# EAGLE design GabozePocaio-Extension-Button-Audio (EAGLE 9.0.0)
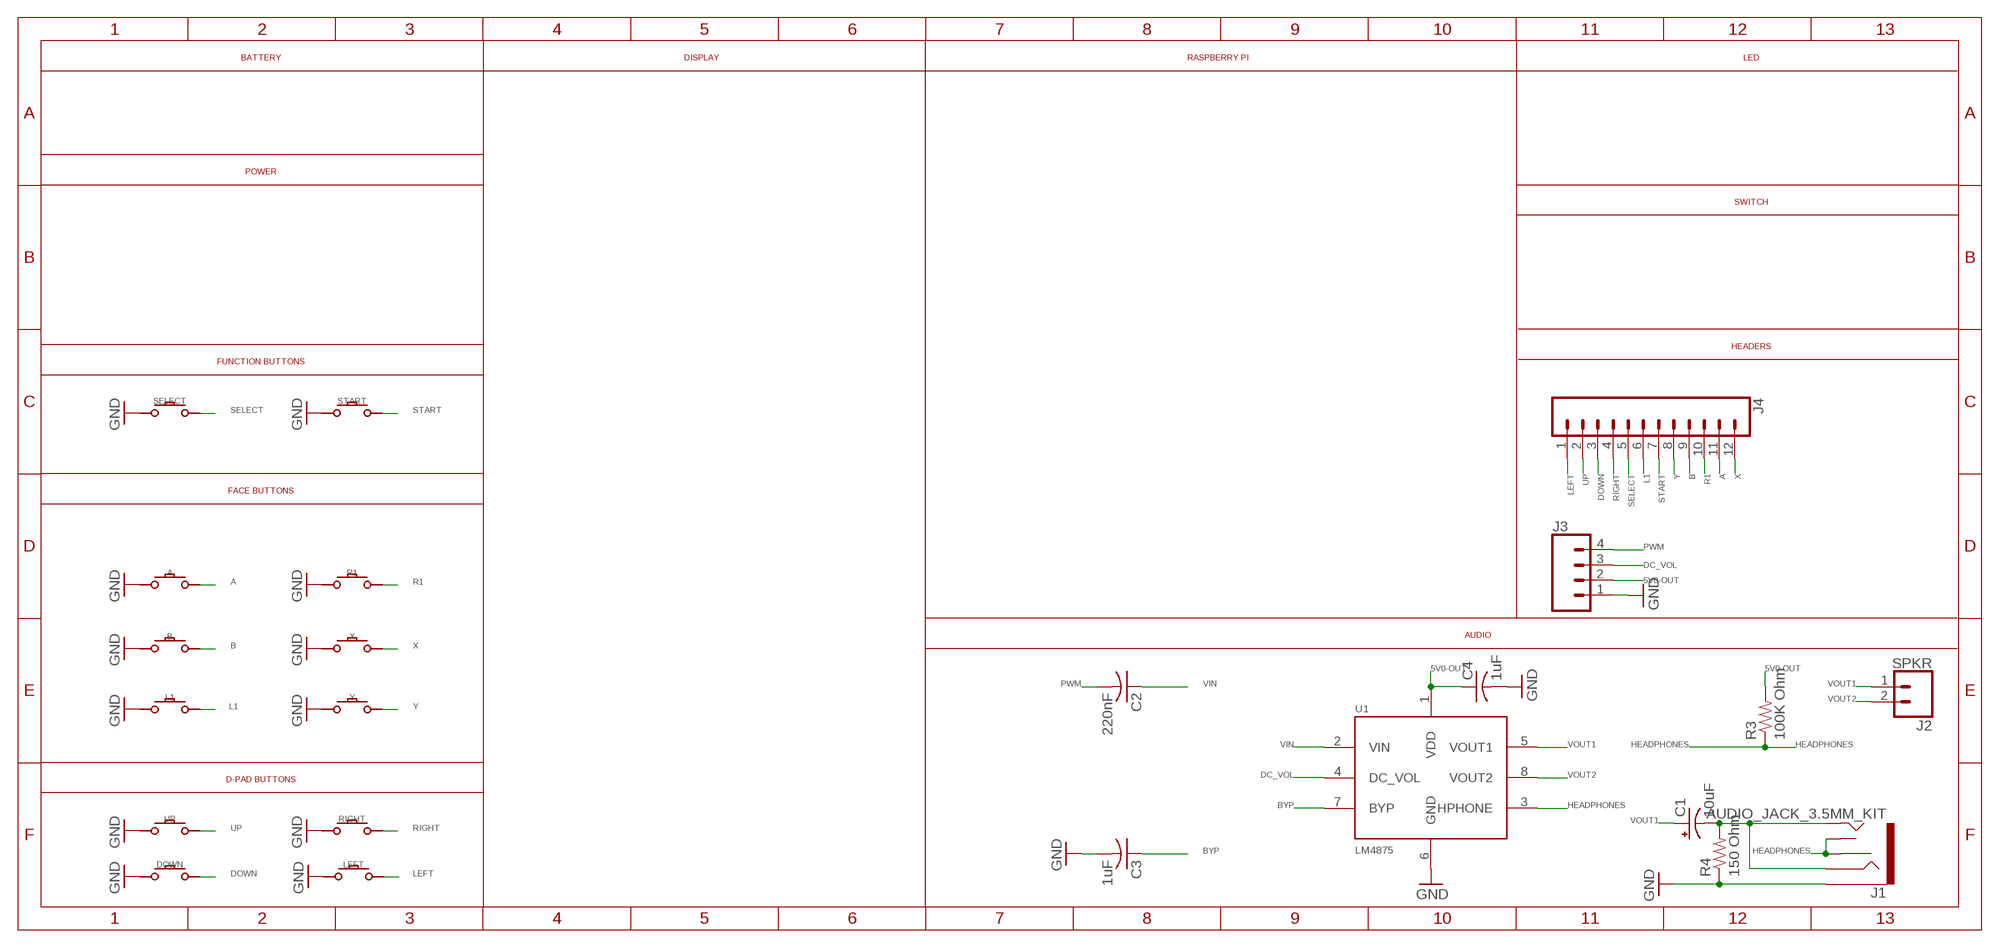
[diagram p0: schematic, sheet 1]

## Parts
A  CONDUCTIVE_BUTTON  [CONDUCTIVE_BUTTON]
B  CONDUCTIVE_BUTTON  [CONDUCTIVE_BUTTON]
C1  10uF  10UF-POLAR-EIA3216-16V-10%(TANT)  [EIA3216]
C2  220nF  C-USC0805  [C0805]
C3  1uF  C-USC0805  [C0805]
C4  1uF  C-USC0805  [C0805]
DOWN  CONDUCTIVE_BUTTON  [CONDUCTIVE_BUTTON]
J1  AUDIO_JACK_3.5MM_KIT  [AUDIO-JACK-KIT]
J2  SPKR  CONN_02  [1X02]
J3  CONN_041X04_NO_SILK  [1X04_NO_SILK]
J4  CONN_12NO_SILK  [1X12_NO_SILK]
L1  CONDUCTIVE_BUTTON_DRILL  [CONDUCTIVE_BUTTON_DRILL]
LEFT  CONDUCTIVE_BUTTON  [CONDUCTIVE_BUTTON]
R1  CONDUCTIVE_BUTTON_DRILL  [CONDUCTIVE_BUTTON_DRILL]
R3  100K Ohm  R-US_R0805  [R0805]
R4  150 Ohm  R-US_R0805  [R0805]
RIGHT  CONDUCTIVE_BUTTON  [CONDUCTIVE_BUTTON]
SELECT  CONDUCTIVE_BUTTON_STARTSELECT  [CONDUCTIVE_BUTTON_STARTSELECT]
START  CONDUCTIVE_BUTTON_STARTSELECT  [CONDUCTIVE_BUTTON_STARTSELECT]
U1  LM4875  [SOIC8]
UP  CONDUCTIVE_BUTTON  [CONDUCTIVE_BUTTON]
X  CONDUCTIVE_BUTTON_DRILL  [CONDUCTIVE_BUTTON_DRILL]
Y  CONDUCTIVE_BUTTON_DRILL  [CONDUCTIVE_BUTTON_DRILL]

## Nets
5V0-OUT: C4.1 J3.2 R3.2 U1.1(VDD)
A: A.P$ACTIVE J4.11
B: B.P$ACTIVE J4.9
BYP: C3.1 U1.7(BYP)
DC_VOL: J3.3 U1.4(DC_VOL)
DOWN: DOWN.P$ACTIVE J4.3
GND: A.P$GND B.P$GND C3.2 C4.2 DOWN.P$GND J1.SLEEVE J3.1 L1.P$GND LEFT.P$GND R1.P$GND R4.1 RIGHT.P$GND SELECT.P$GND START.P$GND U1.6(GND) UP.P$GND X.P$GND Y.P$GND
HEADPHONES: J1.RSH J1.TSH R3.1 U1.3(HPHONE)
L1: J4.6 L1.P$ACTIVE
LEFT: J4.1 LEFT.P$ACTIVE
PWM: C2.2 J3.4
R1: J4.10 R1.P$ACTIVE
RIGHT: J4.4 RIGHT.P$ACTIVE
SELECT: J4.5 SELECT.P$ACTIVE
START: J4.7 START.P$ACTIVE
UP: J4.2 UP.P$ACTIVE
VIN: C2.1 U1.2(VIN)
VIN1: C1.- J1.RING J1.TIP R4.2
VOUT1: C1.+ J2.1 U1.5(VOUT1)
VOUT2: J2.2 U1.8(VOUT2)
X: J4.12 X.P$ACTIVE
Y: J4.8 Y.P$ACTIVE

## Notes on the sheet
- BATTERY | DISPLAY | RASPBERRY PI | LED
- POWER
- SWITCH
- HEADERS
- FUNCTION BUTTONS
- FACE BUTTONS
- AUDIO
- D-PAD BUTTONS

## Library data of the parts
A B DOWN LEFT RIGHT UP = ConductiveButtons:CONDUCTIVE_BUTTON
C1 = SparkFun-Capacitors:10UF-POLAR: 10.0µF polarized capacitors A capacitor is a passive two-terminal electrical component used to store electrical energy temporarily in an electric field.; PROD_ID: CAP-00811
C2-C4 = adafruit:C-US: CAPACITOR, American symbol
J1 = SparkFun-Connectors:AUDIO_JACK_3.5MM: Audio Jack 3.5mm variants of PTH and SMT stereo audio jack with bypass switches. SparkFun Products: SparkFun SparkPunk Sound Kit <[https://www.sparkfun.com/products/11177]> - PTH MP3 Trigger <https://www.sparkfun.com/products/13720> -3.5mm SMD SparkFun PicoBoard <https://www.sparkfun.com/products/11888>- 2.5mm SMD; PROD_ID: CONN-08774; SF_ID: PRT-08032
J2 = SparkFun-Connectors:CONN_02: Multi connection point. Often used as Generic Header-pin footprint for 0.1 inch spaced/style header connections On any of the 0.1 inch spaced packages, you can populate with these: Break Away Headers - Straight <https://www.sparkfun.com/products/116> (PRT-00116) Break Away Male Headers - Right Angle <https://www.sparkfun.com/products/553> (PRT-00553) Female Headers <https://www.sparkfun.com/products/115> (PRT-00115) Break Away Headers - Machine Pin <https://www.sparkfun.com/products/117> (PRT-00117) Break Away Female Headers - Swiss Machine Pin <https://www.sparkfun.com/products/743> (PRT-00743) For SCREWTERMINALS and SPRING TERMINALS visit here: Screw Terimnals on SparkFun.com <https://www.sparkfun.com/search/results?term=Screw+Terminals> (5mm/3.5mm/2.54mm spacing) This device is also useful as a general connection point to wire up your design to another part of your project. Our various solder wires solder well into these plated through hole pads. Hook-Up Wire - Assortment (Stranded, 22 AWG) <https://www.sparkfun.com/products/11375> (PRT-11375) Hook-Up Wire - Assortment (Solid Core, 22 AWG) <https://www.sparkfun.com/products/11367> (PRT-11367) View the entire wire category on our website here <https://www.sparkfun.com/categories/141> Special notes: Molex polarized connector foot print use with: PRT-08233 with associated crimp pins and housings. 2.54_SCREWTERM for use with PRT-10571. 3.5mm Screw Terminal footprints for PRT-08084 5mm Screw Terminal footprints for use with PRT-08432
J3 = SparkFun-Connectors:CONN_04: Multi connection point. Often used as Generic Header-pin footprint for 0.1 inch spaced/style header connections On any of the 0.1 inch spaced packages, you can populate with these: Break Away Headers - Straight <https://www.sparkfun.com/products/116> (PRT-00116) Break Away Male Headers - Right Angle <https://www.sparkfun.com/products/553> (PRT-00553) Female Headers <https://www.sparkfun.com/products/115> (PRT-00115) Break Away Headers - Machine Pin <https://www.sparkfun.com/products/117> (PRT-00117) Break Away Female Headers - Swiss Machine Pin <https://www.sparkfun.com/products/743> (PRT-00743) For SCREWTERMINALS and SPRING TERMINALS visit here: Screw Terimnals on SparkFun.com <https://www.sparkfun.com/search/results?term=Screw+Terminals> (5mm/3.5mm/2.54mm spacing) This device is also useful as a general connection point to wire up your design to another part of your project. Our various solder wires solder well into these plated through hole pads. Hook-Up Wire - Assortment (Stranded, 22 AWG) <https://www.sparkfun.com/products/11375> (PRT-11375) Hook-Up Wire - Assortment (Solid Core, 22 AWG) <https://www.sparkfun.com/products/11367> (PRT-11367) View the entire wire category on our website here <https://www.sparkfun.com/categories/141> Special notes: Molex polarized connector foot print use with SKU : PRT-08231 with associated crimp pins and housings. 1MM SMD Version SKU: PRT-10208; PROD_ID: CONN-09696
J4 = SparkFun-Connectors:CONN_12: Multi connection point. Often used as Generic Header-pin footprint for 0.1 inch spaced/style header connections On any of the 0.1 inch spaced packages, you can populate with these: Break Away Headers - Straight <https://www.sparkfun.com/products/116> (PRT-00116) Break Away Male Headers - Right Angle <https://www.sparkfun.com/products/553> (PRT-00553) Female Headers <https://www.sparkfun.com/products/115> (PRT-00115) Break Away Headers - Machine Pin <https://www.sparkfun.com/products/117> (PRT-00117) Break Away Female Headers - Swiss Machine Pin <https://www.sparkfun.com/products/743> (PRT-00743) For SCREWTERMINALS and SPRING TERMINALS visit here: Screw Terimnals on SparkFun.com <https://www.sparkfun.com/search/results?term=Screw+Terminals> (5mm/3.5mm/2.54mm spacing) This device is also useful as a general connection point to wire up your design to another part of your project. Our various solder wires solder well into these plated through hole pads. Hook-Up Wire - Assortment (Stranded, 22 AWG) <https://www.sparkfun.com/products/11375> (PRT-11375) Hook-Up Wire - Assortment (Solid Core, 22 AWG) <https://www.sparkfun.com/products/11367> (PRT-11367) View the entire wire category on our website here <https://www.sparkfun.com/categories/141> Special notes: Molex polarized connector foot print use with SKU : PRT-08231 with associated crimp pins and housings. 1MM SMD Version SKU: PRT-10208 NOTES ON THE VARIANTS LOCK and LOCK_LONGPADS... This footprint was designed to help hold the alignment of a through-hole component (i.e. 6-pin header) while soldering it into place. You may notice that each hole has been shifted either up or down by 0.005 of an inch from it's more standard position (which is a perfectly straight line). This slight alteration caused the pins (the squares in the middle) to touch the edges of the holes. Because they are alternating, it causes a "brace" to hold the component in place. 0.005 has proven to be the perfect amount of "off-center" position when using our standard breakaway headers. Although looks a little odd when you look at the bare footprint, once you have a header in there, the alteration is very hard to notice. Also,if you push a header all the way into place, it is covered up entirely on the bottom side.
L1 R1 X Y = ConductiveButtons:CONDUCTIVE_BUTTON_DRILL
R3 R4 = adafruit:R-US_: RESISTOR, American symbol
SELECT START = ConductiveButtons:CONDUCTIVE_BUTTON_STARTSELECT
U1 = texas:LM4875

## Board
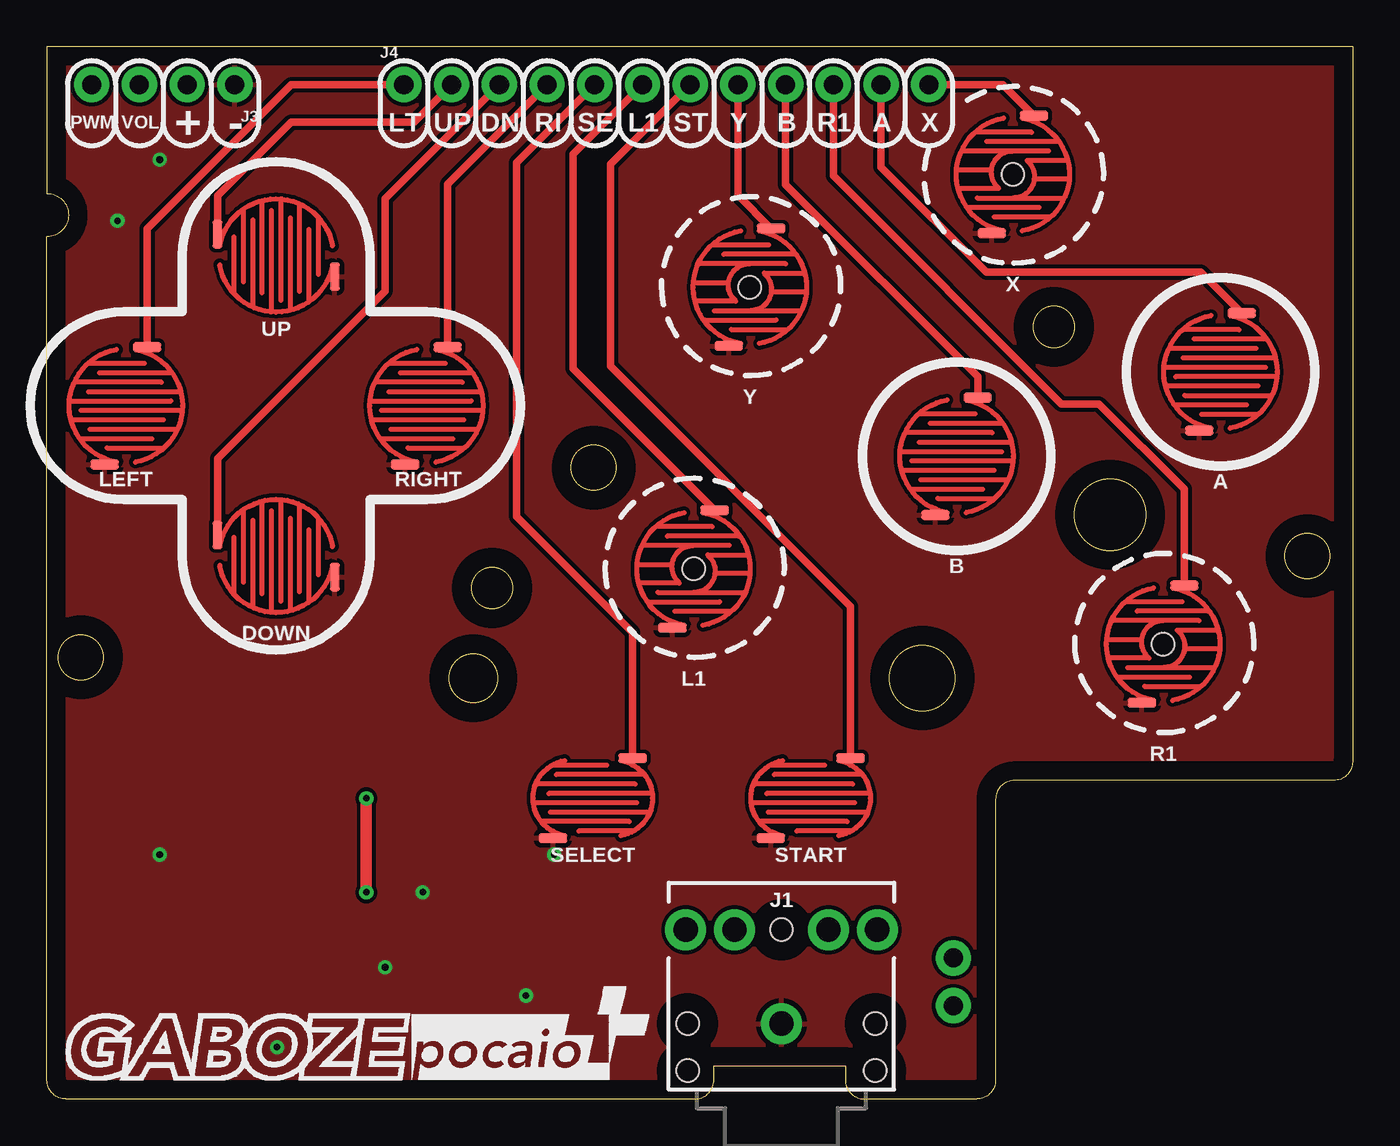
[diagram p1: board, top side]
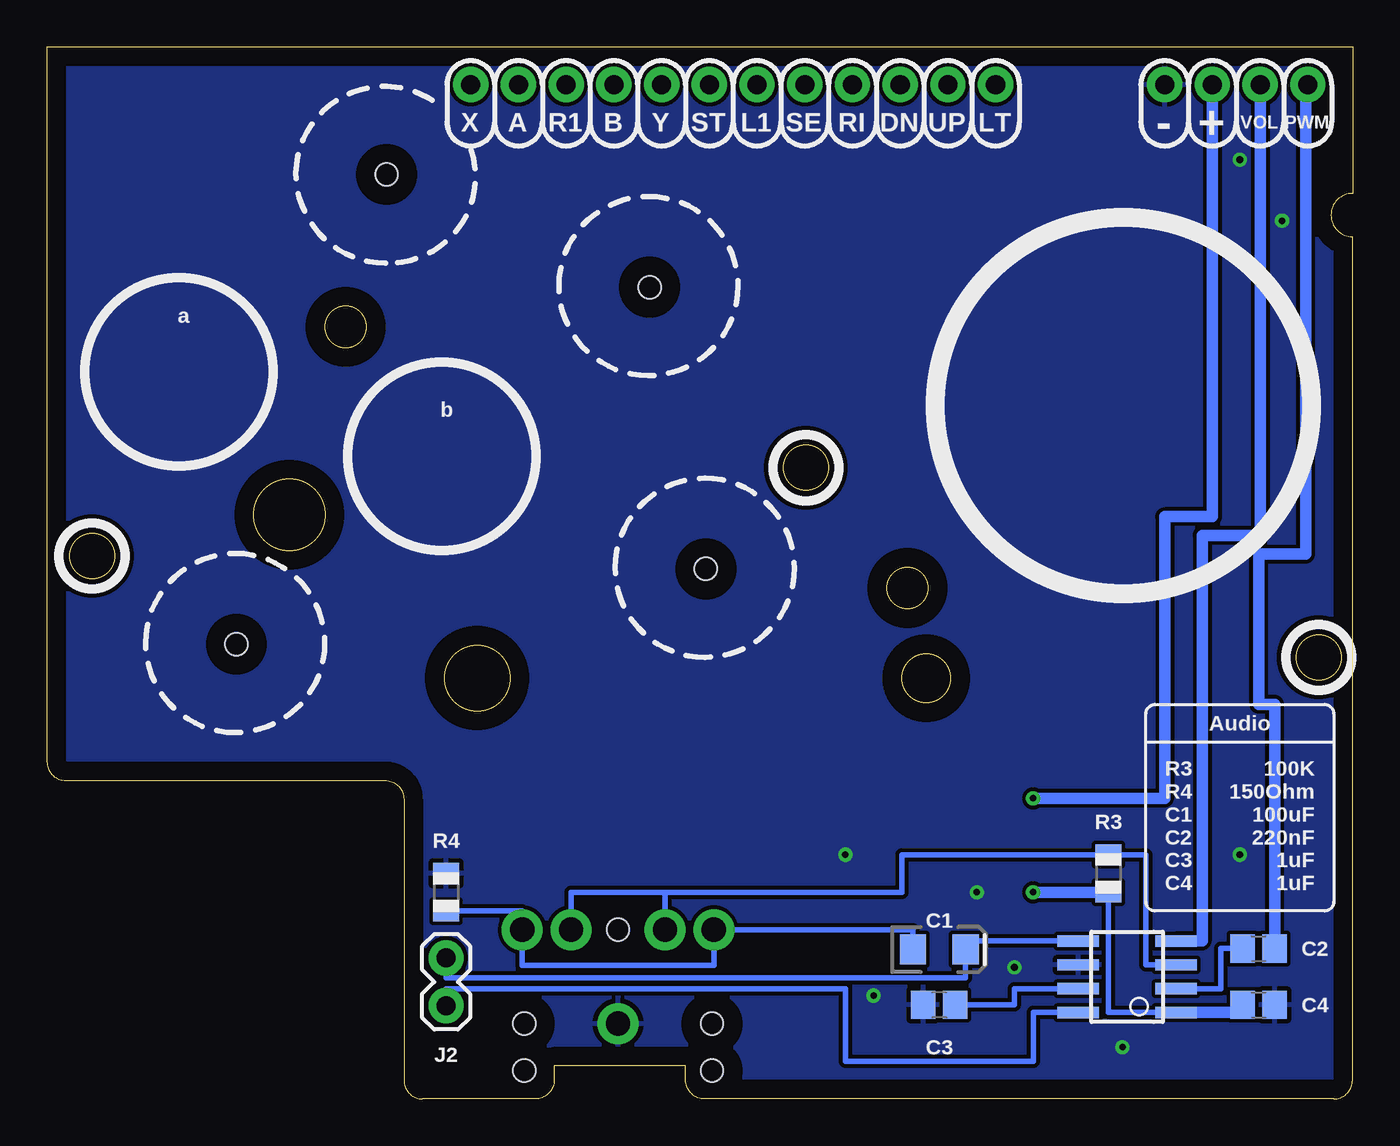
[diagram p2: board, bottom side, seen from below]

Size 69.5 x 56 mm. Coordinates in mm from the lower left corner, seen from the top.
Outline: 69.5,56 69.5,17.95 arc-90 68.5,16.95 51.5,16.95 arc90 50.5,15.95 50.5,1 arc-90 49.5,0 43.5,0 arc-90 42.5,1 42.5,1.75 35.5,1.75 35.5,1 arc-90 34.5,0 1,0 arc-90 0,1 0,45.9 arc180 0,48.2 0,56 69.5,56
Outline: circle at 1.8,23.5 radius 1.2
Outline: circle at 67.1,28.9 radius 1.2
Outline: circle at 56.6,31.1 radius 1.9
Outline: circle at 46.6,22.4 radius 1.75
Outline: circle at 29.1,33.6 radius 1.2
Outline: circle at 23.7,27.2 radius 1.1
Outline: circle at 22.7,22.4 radius 1.3
Outline: circle at 53.6,41.1 radius 1.1
Copper layers (1*16): Top 0.035mm / dielectric 1.5mm / Bottom 0.035mm
Design rules "default *": minimum track width 10mil, minimum drill 24mil, track to track 8mil, track to pad 8mil, pad to pad 8mil, via to via 8mil, smd to smd 8mil, copper to edge 40mil, drill to drill 8mil, minimum pad ring 10mil, minimum via ring 8mil, stop-mask expansion 5mil, vias tented up to drill 10mil, thermal gap 10mil

### Footprints (pad centres in the part's own frame; a part is rotated, then mirrored left to right if it is on the bottom)
CONDUCTIVE_BUTTON = smd 1.5 x 0.508: P$ACTIVE 1.125,3.125; P$GND -1.125,-3.125
EIA3216 = smd 1.4 x 1.6: + 1.4,0; - -1.4,0
C0805 = smd 1.3 x 1.5: 1 -0.85,0; 2 0.85,0
AUDIO-JACK-KIT = drill 1.3 pad 2.184: RING 5,5.1; RSH 5,2.5; SLEEVE 0,0; TIP 5,-5.1; TSH 5,-2.5 | hole 1.2: 0,5; -2.5,5; -2.5,-5; 0,-5; 5,0
1X02 = drill 1.016 pad 1.88: 1 0,0; 2 2.54,0
1X04_NO_SILK = drill 1.016 pad 1.88: 1 0,0; 2 2.54,0; 3 5.08,0; 4 7.62,0
1X12_NO_SILK = drill 1.016 pad 1.88: 1 0,0; 2 2.54,0; 3 5.08,0; 4 7.62,0; 5 10.16,0; 6 12.7,0; 7 15.24,0; 8 17.78,0; 9 20.32,0; 10 22.86,0; 11 25.4,0; 12 27.94,0
CONDUCTIVE_BUTTON_DRILL = smd 1.5 x 0.508: P$ACTIVE 1.125,3.125; P$GND -1.125,-3.125 | hole 1.2: 0,0
R0805 = smd 1.1 x 1.4: 1 -1,0; 2 1,0
CONDUCTIVE_BUTTON_STARTSELECT = smd 1.5 x 0.508: P$ACTIVE 2.125,2.125; P$GND -2.125,-2.125
SOIC8 = smd 0.6 x 2.2: 1 -1.905,-2.6; 2 -0.635,-2.6; 3 0.635,-2.6; 4 1.905,-2.6; 5 1.905,2.6; 6 0.635,2.6; 7 -0.635,2.6; 8 -1.905,2.6

### Placement (x,y rotation side)
A  62.47,38.7 0 top
B  48.42,34.21 0 top
C1  22,7.95 0 bottom
C2  5,8 0 bottom
C3  22,5 180 bottom
C4  5,5 0 bottom
DOWN  12.2,28.9 90 top
J1  39.1,4 90 top
J2  48.25,7.5 270 bottom
J3  10,54 180 top
J4  19,54 0 top
L1  34.42,28.21 0 top
LEFT  4.2,36.9 0 top
R1  59.42,24.21 0 top
R3  13,12 270 bottom
R4  48.25,11 270 bottom
RIGHT  20.2,36.9 0 top
SELECT  29.05,16.01 0 top
START  40.66,16.01 0 top
U1  12,6.5 90 bottom
UP  12.2,44.9 90 top
X  51.42,49.21 0 top
Y  37.42,43.21 0 top

### Tracks (layer width: path | path; a pad name or v marks a point on that pad's centre or on a via)
5V0-OUT  (via drill 0.35)
  Top 0.61: v17,16 v17,11
  Bottom 0.305: R3.2 13,4.59 9,4.59
  Bottom 0.61: U1.1 9,4.59 5.85,4.59 C4.1 | J3.2 7.46,31 10,31 10,16 v17,16 | v17,11 R3.2
A
  Top 0.406: A.P$ACTIVE 61.42,44 50,44 44.4,49.6 J4.11
B
  Top 0.406: B.P$ACTIVE 49.55,38.45 39.32,48.68 J4.9
BYP
  Bottom 0.305: U1.7 18,5.87 18,5 C3.1
DC_VOL
  Bottom 0.61: J3.3 4.92,30 8,30 8,8.4 U1.4
DOWN
  Top 0.406: DOWN.P$ACTIVE 9.07,34.08 18,43 18,47.92 J4.3
GND  (via drill 0.35)
  other vias: 12.25,2.75 6,13 18,7 25.5,5.5 20,11 27,13 3.75,46.75 6,50
  pour Top: 0,56 69.5,56 69.5,17 50.5,17 50.5,0 0,0
  pour Bottom: 0,56 69.5,56 69.5,17 50.5,17 50.5,0 0,0
HEADPHONES
  Bottom 0.305: U1.3 11,7.13 11,13 R3.1 24,13 24,11 36.6,11 | J1.TSH 41.6,11 36.6,11 | 36.6,11 J1.RSH
L1
  Top 0.406: L1.P$ACTIVE 28,38.88 28,50.3 J4.6
LEFT
  Top 0.406: LEFT.P$ACTIVE 5.33,46.33 13,54 J4.1
PWM
  Bottom 0.61: C2.2 4.15,21 5,21 5,29 2.5,29 2.5,53.88 J3.4
R1
  Top 0.406: R1.P$ACTIVE 60.55,32.45 56,37 54,37 41.86,49.14 J4.10
RIGHT
  Top 0.406: RIGHT.P$ACTIVE 21.32,48.7 J4.4
SELECT
  Top 0.406: SELECT.P$ACTIVE 31.18,24.82 25,31 25,49.84 J4.5
START
  Top 0.406: START.P$ACTIVE 42.78,26.22 30,39 30,49.76 J4.7
UP
  Top 0.406: UP.P$ACTIVE 9.07,48.08 13,52 19.54,52 J4.2
VIN
  Bottom 0.305: C2.1 7,8 7,5.87 U1.2
VIN1
  Bottom 0.305: C1.- 23.4,9 J1.RING 34,7.1 44.2,7.1 J1.TIP 44.2,10 R4.2
VOUT1
  Bottom 0.305: U1.5 20.6,8.4 C1.+ 20.6,6.45 48.25,6.45 J2.1
VOUT2
  Bottom 0.305: U1.8 17,4.59 17,2 27,2 27,5.85 48.25,5.85 J2.2
X
  Top 0.406: X.P$ACTIVE 50.88,54 J4.12
Y
  Top 0.406: Y.P$ACTIVE 36.78,48.1 J4.8

### Text on the board
tPlace: PWM | VOL | + | - | LT | UP | DN | RI | SE | L1 | ST | Y | B | R1 | A | X
bPlace: PWM | VOL | + | - | LT | UP | DN | RI | SE | L1 | ST | Y | B | R1 | A | X | a | b | Audio | 100K / 150Ohm / 100uF / 220nF / 1uF / 1uF | R3 / R4 / C1 / C2 / C3 / C4 | R3 | R4 | C1 | C2 | C4 | C3